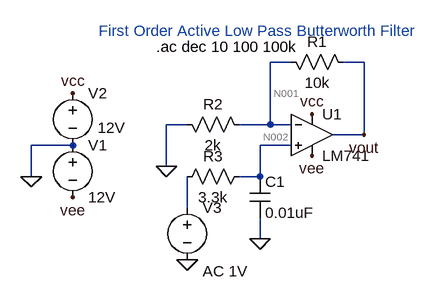
[diagram p0: schematic first_order_active_low_pass.asc]
first_order_active_low_pass.asc, the LTspice schematic file:
Version 4.1
SHEET 1 880 680
WIRE 272 80 240 80
WIRE 384 80 352 80
WIRE 112 176 80 176
WIRE 240 176 240 80
WIRE 240 176 192 176
WIRE 272 176 240 176
WIRE 384 192 384 80
WIRE 384 192 336 192
WIRE -64 208 -128 208
WIRE 272 208 224 208
WIRE 80 240 80 176
WIRE -128 256 -128 208
WIRE 224 256 224 208
WIRE 224 256 192 256
WIRE 112 304 112 256
WIRE 224 352 224 320
FLAG -128 256 0
FLAG 304 160 vcc
FLAG -64 128 vcc
FLAG -64 288 vee
FLAG 304 224 vee
FLAG 80 240 0
FLAG 224 352 0
FLAG 112 384 0
FLAG 384 192 vout
SYMBOL voltage -64 192 R0
WINDOW 123 0 0 Left 0
WINDOW 39 0 0 Left 0
SYMATTR InstName V1
SYMATTR Value 12V
SYMBOL voltage -64 112 R0
WINDOW 3 38 69 Left 2
WINDOW 123 0 0 Left 0
WINDOW 39 0 0 Left 0
SYMATTR Value 12V
SYMATTR InstName V2
SYMBOL LM741 304 128 R0
SYMATTR InstName U1
SYMBOL res 256 64 M90
WINDOW 0 0 56 VBottom 2
WINDOW 3 32 56 VTop 2
SYMATTR InstName R1
SYMATTR Value 10k
SYMBOL res 96 160 M90
WINDOW 0 0 56 VBottom 2
WINDOW 3 32 56 VTop 2
SYMATTR InstName R2
SYMATTR Value 2k
SYMBOL cap 208 256 R0
SYMATTR InstName C1
SYMATTR Value 0.01uF
SYMBOL res 96 272 R270
WINDOW 0 32 56 VTop 2
WINDOW 3 0 56 VBottom 2
SYMATTR InstName R3
SYMATTR Value 3.3k
SYMBOL voltage 112 288 R0
WINDOW 123 24 114 Left 2
WINDOW 39 0 0 Left 0
SYMATTR Value2 AC 1V
SYMATTR InstName V3
SYMATTR Value ""
TEXT -24 32 Left 2 ;First Order Active Low Pass Butterworth Filter
TEXT 64 56 Left 2 !.ac dec 10 100 100k

The netlist it stands for:
* first_order_active_low_pass.asc
V1 0 vee 12V
V2 vcc 0 12V
X§U1 N002 N001 vcc vee vout LM741  ; pins In+ In- V+ V- OUT
R1 N001 vout 10k
R2 0 N001 2k
C1 N002 0 0.01uF
R3 N003 N002 3.3k
V3 N003 0 AC 1V
* First Order Active Low Pass Butterworth Filter
.ac dec 10 100 100k
.lib LM741.lib
.backanno
.end

* Results of the author's LTspice run, read from the files saved beside the schematic
* Operating Point, zero values left out:
*   V(vcc) = 12 V
*   V(n001) = 809 µV
*   V(vout) = 5.873 mV
*   V(vee) = -12 V
*   V(n002) = -190.9 µV
*   I(V1) = -1.626 mA
*   I(R2) = -404.5 nA
*   I(R3) = 57.86 nA
*   I(V3) = -57.86 nA
*   I(V2) = -1.626 mA
*   I(R1) = -506.4 nA
*   Ix(u1:1) = 57.86 nA
*   Ix(u1:2) = 101.9 nA
*   Ix(u1:99) = 1.626 mA
*   Ix(u1:50) = -1.626 mA
*   Ix(u1:28) = -506.4 nA
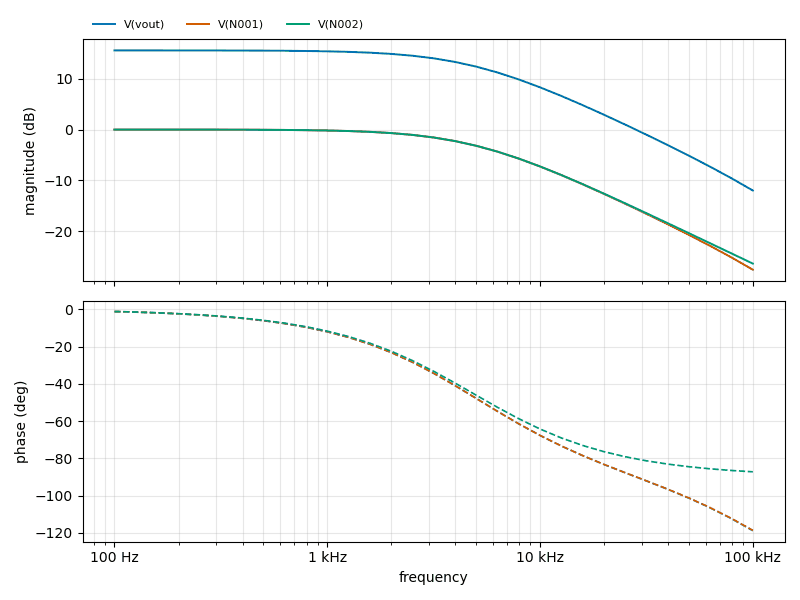
[diagram p1: AC Analysis of first_order_active_low_pass.asc, plotted from the saved traces]
* AC Analysis, 1 run:
*   V(vout): 15.56 dB at 100 Hz, -11.98 dB at 100 kHz, peak 15.56 dB at 100 Hz, 3 dB below the peak at 4.8 kHz
*   V(N001): -0.00 dB at 100 Hz, -27.54 dB at 100 kHz, peak -0.00 dB at 100 Hz, 3 dB below the peak at 4.8 kHz
*   V(N002): -0.00 dB at 100 Hz, -26.35 dB at 100 kHz, peak -0.00 dB at 100 Hz, 3 dB below the peak at 4.804 kHz